# Altium schematic sheet CircuitoC1NoWroomRAJP.SchDoc
size A4; SheetNumber: 1; SheetTotal: 1
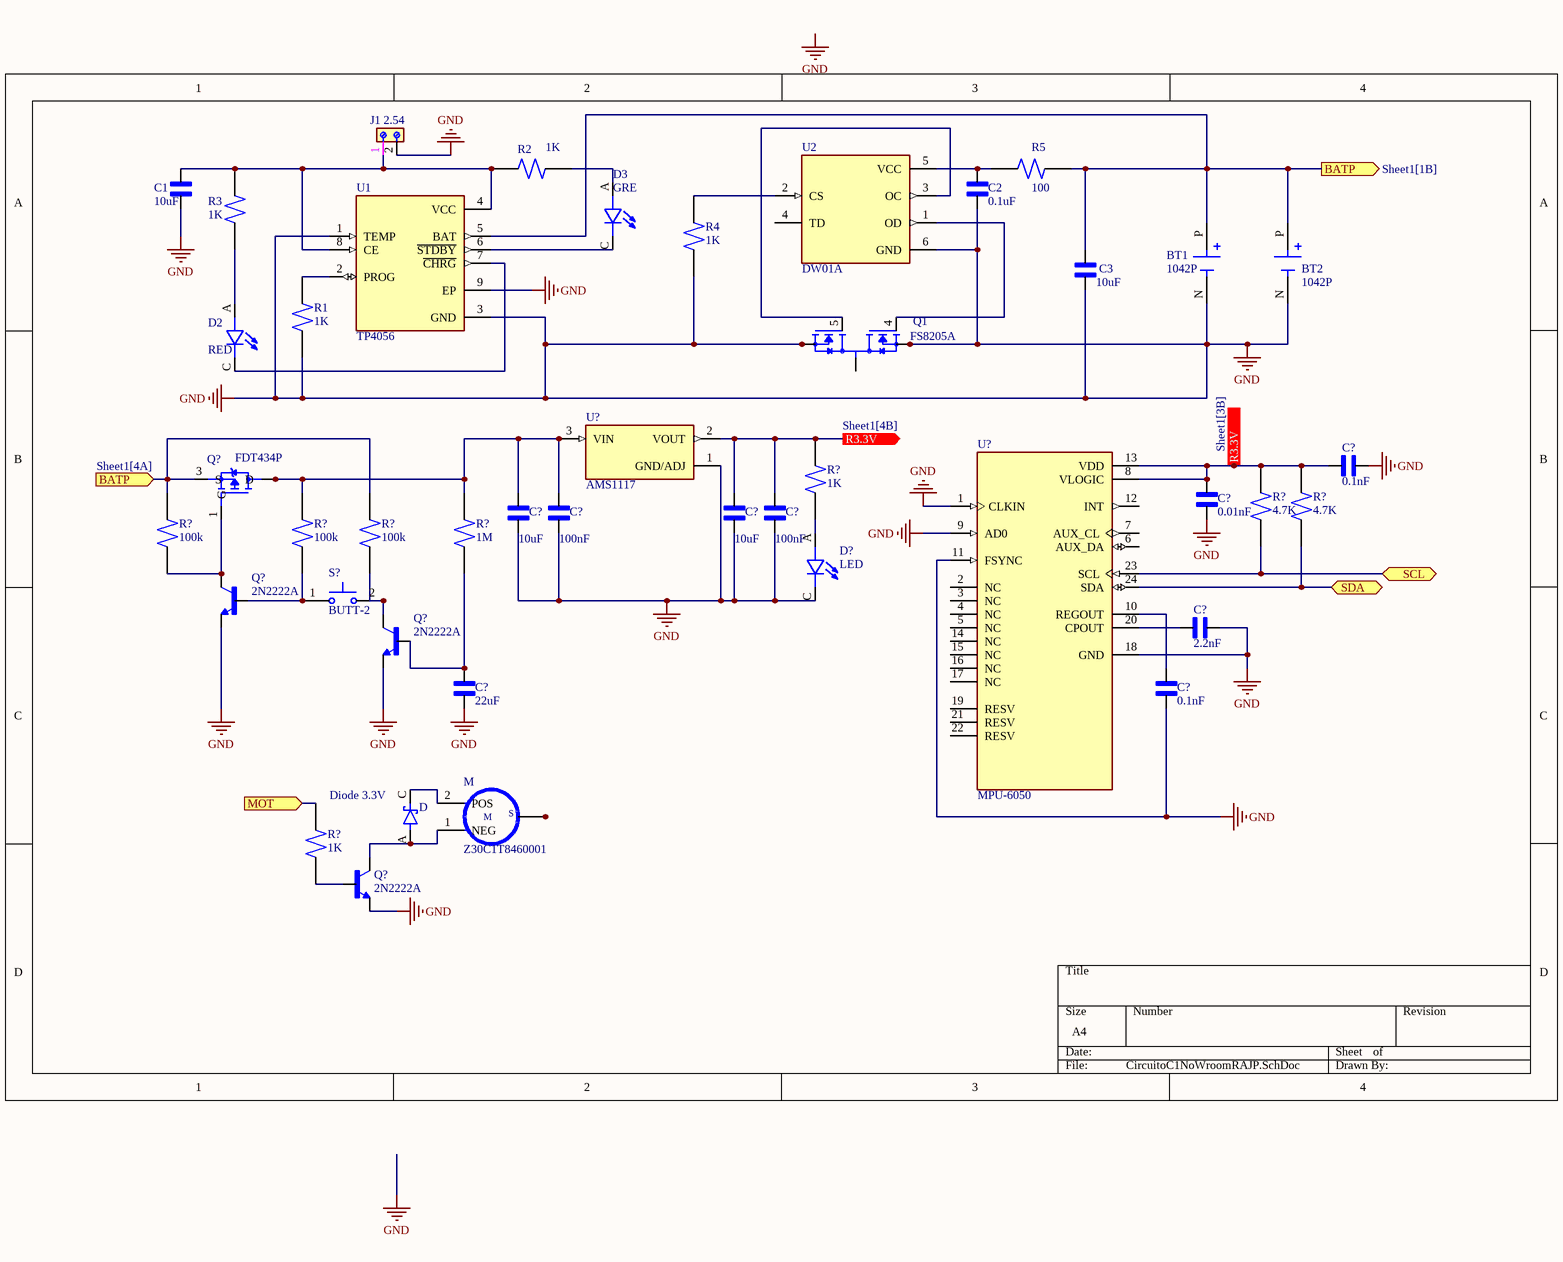
[diagram p0: CircuitoC1NoWroomRAJP.SchDoc]

## Parts
(Parts that share a designator on the sheet are numbered #1, #2 ... from top to bottom, then left to right.)
BT1  1042P  [BAT_1042P]
BT2  1042P  [BAT_1042P]
C1  10uF  [CAPC2012X94N]
C2  0.1uF  [CAPC2012X94N]
C3  10uF  [CAPC2012X94N]
C?#1  0.1nF  [CAPC2012X94N]
C?#2  0.01nF  [CAPC2012X94N]
C?#3  10uF  [CAPC2012X94N]
C?#4  100nF  [CAPC2012X94N]
C?#5  10uF  [CAPC2012X94N]
C?#6  100nF  [CAPC2012X94N]
C?#7  2.2nF  [CAPC2012X94N]
C?#8  22uF  [CAPC2012X94N]
C?#9  0.1nF  [CAPC2012X94N]
D  Diode 3.3V  [DIOSC130X200X100-2N]
D2  RED  [LEDC2012X120N]
D3  GRE  [LEDC2012X120N]
D?  LED  [LEDC2012X120N]
J1  2.54  [691210910002]
M  Z30C1T8460001  [XDCR_Z30C1T8460001]
Q1  FS8205A  [SOP65P640X120-8N]
Q?#1  FDT434P  [SOT230P700X180-4N]
Q?#2  2N2222A  [TO92254P470H750-3]
Q?#3  2N2222A  [TO92254P470H750-3]
Q?#4  2N2222A  [TO92254P470H750-3]
R1  1K  [RESC2012X60N]
R2  1K  [RESC2012X60N]
R3  1K  [RESC2012X60N]
R4  1K  [RESC2012X60N]
R5  100  [RESC2012X60N]
R?#1  1K  [RESC2012X60N]
R?#2  4.7K  [RESC2012X60N]
R?#3  4.7K  [RESC2012X60N]
R?#4  100k  [RESC2012X60N]
R?#5  100k  [RESC2012X60N]
R?#6  100k  [RESC2012X60N]
R?#7  1M  [RESC2012X60N]
R?#8  1K  [RESC2012X60N]
S?  BUTT-2  [SW_BUTT-2]
U1  TP4056  [SOP127P600X175-9N]
U2  DW01A  [SOT95P280X145-6N]
U?#1  AMS1117  [SOT229P700X180-4N]
U?#2  MPU-6050  [QFN50P400X400X95-24N]

## Ports
BATP (in, see Sheet1[4A]), BATP (out, see Sheet1[1B]), MOT (in), R3.3V (in, see Sheet1[3B]), R3.3V (out, see Sheet1[4B]), SCL (bidir), SDA (bidir)

## Nets
GND: BT1.N(NEG) BT2.N(NEG) C1.1 C2.2 C3.1 C?#1.2 C?#2.1 C?#3.1 C?#4.1 C?#5.1 C?#6.1 C?#7.1 C?#8.1 C?#9.1 D?.C J1.2 Q1.2(S1) Q1.3(S1) Q1.6(S2) Q1.7(S2) Q?#2.1(E) Q?#3.1(E) Q?#4.1(E) R1.1 R4.1 U1.1(TEMP) U1.3(GND) U1.9(EP) U2.6(GND) U?#1.1(GND/ADJ) U?#2.1(CLKIN) U?#2.9(AD0) U?#2.11(FSYNC) U?#2.18(GND)
BATP: BT1.P(POS) BT2.P(POS) C3.2 Q?#1.3(S) R5.2 R?#4.2 R?#6.2 U1.5(BAT) ; port BATP
MOT: R?#8.2 ; port MOT
R3.3V: C?#1.1 C?#2.2 C?#5.2 C?#6.2 R?#1.2 R?#2.2 R?#3.2 U?#1.2(VOUT) U?#2.8(VLOGIC) U?#2.13(VDD) ; port R3.3V
SCL: R?#2.1 U?#2.23(SCL) ; port SCL
SDA: R?#3.1 U?#2.24(SDA) ; port SDA
NetC1_2: C1.2 J1.1 R2.1 R3.2 U1.4(VCC) U1.8(CE)
NetC2_1: C2.1 R5.1 U2.5(VCC)
NetC?#3_2: C?#3.2 C?#4.2 Q?#1.2(D) Q?#1.4(D) R?#5.2 R?#7.2 U?#1.3(VIN)
NetC?#7_2: C?#7.2 U?#2.20(CPOUT)
NetC?#8_2: C?#8.2 Q?#3.2(B) R?#7.1
NetC?#9_2: C?#9.2 U?#2.10(REGOUT)
NetD2_A: D2.A R3.1
NetD2_C: D2.C U1.7(~{CHRG})
NetD3_A: D3.A R2.2
NetD3_C: D3.C U1.6(~{STDBY})
NetD?_A: D?.A R?#1.1
NetD_A: D.A M.1(NEG) Q?#4.3(C)
NetD_C: D.C(K) M.2(POS)
NetM_3: M.3(SHIELD) M.4(SHIELD) M.5(SHIELD) M.6(SHIELD)
NetQ1_1: Q1.1(D12) Q1.8(D12)
NetQ1_4: Q1.4(G1) U2.1(OD)
NetQ1_5: Q1.5(G2) U2.3(OC)
NetQ?#1_1: Q?#1.1(G) Q?#2.3(C) R?#4.1
NetQ?#2_2: Q?#2.2(B) R?#5.1 S?.1
NetQ?#3_3: Q?#3.3(C) R?#6.1 S?.2
NetQ?#4_2: Q?#4.2(B) R?#8.1
NetR1_2: R1.2 U1.2(PROG)
NetR4_2: R4.2 U2.2(CS)

Not connected (* = marked no-connect by the designer): U2 4(TD); U?#2 2(NC) 3(NC) 4(NC) 5(NC) 6(AUX_DA) 7(AUX_CL) 12(INT) 14(NC) 15(NC) 16(NC) 17(NC) 19(RESV) 21(RESV) 22(RESV)

## Notes on the sheet
- Labels drawn without touching a wire or pin: GND
- (in symbol Z30C1T8460001) S

## Library data of the parts
BT1 BT2 = 1042P: SMT Polarized Holder for 18650 Battery; MF: Keystone Electronics; Price: None; Purchase-URL: https://pricing.snapeda.com/search/part/1042P/?ref=eda; Check_prices: https://www.snapeda.com/parts/1042P/Keystone+Electronics/view-part/?ref=eda; Value: *; SnapEDA_Link: https://www.snapeda.com/parts/1042P/Keystone+Electronics/view-part/?ref=snap; Availability: In Stock; MP: 1042P; Package: None
C1-C3 C?#1-C?#9 = 0805YC103J4T2A: 10000 pF Â±5% 16V Ceramic Capacitor X7R 0805 (2012 Metric); MF: AVX; SnapEDA_Link: https://www.snapeda.com/parts/0805YC103J4T2A/AVX/view-part/?ref=snap; Package: 2012 AVX; Value: *; MP: 0805YC103J4T2A; Check_prices: https://www.snapeda.com/parts/0805YC103J4T2A/AVX/view-part/?ref=eda
D = SD0805S040S0R1: Diode Schottky 40V 100mA (DC) Surface Mount 0805 (2012 Metric); MF: AVX; DigiKey-Purchase-URL: https://snapeda.com/shop?store=DigiKey&id=809038; Arrow_Electronics-Purchase-URL: https://snapeda.com/shop?store=Arrow+Electronics&id=809038; Availability: Good; Price: None; Value: *; SnapEDA_Link: https://www.snapeda.com/parts/SD0805S040S0R1/AVX/view-part/809038/?ref=snap; MP: SD0805S040S0R1; Package: 0805 AVX; Mouser-Purchase-URL: https://snapeda.com/shop?store=Mouser&id=809038
D2 D3 D? = SML-LXT0805IW-TR: LED;Red;11mcd;0.061In.Dia.;SMD;100mA;2V Vf;635nm;140deg;SMD;White Diffused;5V Vr | Lumex SML-LXT0805IW-TR; MF: Lumex Opto/Components; SnapEDA_Link: https://www.snapeda.com/parts/SML-LXT0805IW-TR/Lumex+Opto%252FComponents+Inc./view-part/?ref=snap; Package: 0805 Lumex; Value: *; MP: SML-LXT0805IW-TR; Check_prices: https://www.snapeda.com/parts/SML-LXT0805IW-TR/Lumex+Opto%252FComponents+Inc./view-part/?ref=eda
J1 = 691210910002: MF: {'manufacturer': u'W\xfcrth Elektronik'}; Package: None; Price: None; Value: *; MP: 691210910002; Availability: Unavailable
M = Z30C1T8460001: DC Motor Vibration, ERM 15000 RPM 2.7VDC; MF: Jinlong Machinery; Package: Jinlong Machinery &amp; Electronics; SnapEDA_Link: https://www.snapeda.com/parts/Z30C1T8460001/Jinlong%20Machinery%20%26%20Electronics%2C%20Inc./view-part/585010/?ref=snap; MP: Z30C1T8460001; Value: *; Availability: Unavailable; Price: None
Q1 = FS8205A: MF: Fortune Semiconductor; SnapEDA_Link: https://www.snapeda.com/parts/FS8205A/Fortune+Semiconductor/view-part/?ref=snap; Package: Package; Value: *; MP: FS8205A; Check_prices: https://www.snapeda.com/parts/FS8205A/Fortune+Semiconductor/view-part/?ref=eda
Q?#1 = FDT434P: P-Channel 20 V 6A (Ta) 3W (Ta) Surface Mount SOT-223-4; MF: ON; SnapEDA_Link: https://www.snapeda.com/parts/FDT434P/Onsemi/view-part/?ref=snap; Package: SOT-223-4 Fairchild Semiconductor; Value: *; MP: FDT434P; Check_prices: https://www.snapeda.com/parts/FDT434P/Onsemi/view-part/?ref=eda
Q?#2-Q?#4 = 2N2222A: BJT, TO-92, 40V, 600mA, NPN, 0.625W, 150Â°C; MF: Diotec Semiconductor; SnapEDA_Link: https://www.snapeda.com/parts/2N2222A/Diotec/view-part/?ref=snap; Package: TO-92 Diotec; Value: *; MP: 2N2222A; Check_prices: https://www.snapeda.com/parts/2N2222A/Diotec/view-part/?ref=eda
R1-R5 R?#1-R?#8 = RC0805FR-07910RL: 910 Ohms Â±1% 0.125W, 1/8W Chip Resistor 0805 (2012 Metric) Moisture Resistant Thick Film; MF: Yageo; Package: 2012 Rohm Semiconductor; Value: *; Purchase-URL: https://pricing.snapeda.com/search/part/RC0805FR-07910RL/?ref=eda; Availability: In Stock; MP: RC0805FR-07910RL; Price: None
S? = BUTT-2: Tactile Switches MINI PUSH BUTTON SWITCH 2-PIN QTY. 4; MF: Gravitech; Purchase-URL: https://pricing.snapeda.com/search/part/BUTT-2/?ref=eda; Package: None; Value: *; Check_prices: https://www.snapeda.com/parts/BUTT-2/Gravitech/view-part/?ref=eda; SnapEDA_Link: https://www.snapeda.com/parts/BUTT-2/Gravitech/view-part/?ref=snap; Availability: In Stock; Price: None; MP: BUTT-2
U1 = TP4056: Complete single cell Li-Ion battery with a constant current / constant voltage linear charger; MF: NanJing Top Power ASIC Corp.; Check_prices: https://www.snapeda.com/parts/TP4056/NanJing+Top+Power+ASIC+Corp./view-part/?ref=eda; SnapEDA_Link: https://www.snapeda.com/parts/TP4056/NanJing+Top+Power+ASIC+Corp./view-part/?ref=snap; Price: None; Availability: Not in stock; Package: Package; MP: TP4056; Value: *
U2 = DW01A: One Cell Lithium-ion/Polymer Battery Protection IC; MF: Fortune Semiconductor; SnapEDA_Link: https://www.snapeda.com/parts/DW01A/Fortune+Semiconductor/view-part/?ref=snap; Package: SOT-23-6 Fortune Semiconductor; Value: *; MP: DW01A; Check_prices: https://www.snapeda.com/parts/DW01A/Fortune+Semiconductor/view-part/?ref=eda
U?#1 = AMS1117-3.3: LDO Voltage Regulators 800MA LDO LINEAR REG; MF: ams AG; SnapEDA_Link: https://www.snapeda.com/parts/AMS1117-3.3/ams/view-part/?ref=snap; Package: SOT-223 Seeed Technology; Value: *; MP: AMS1117-3.3; Check_prices: https://www.snapeda.com/parts/AMS1117-3.3/ams/view-part/?ref=eda
U?#2 = MPU-6050: MPU-6050 series Accelerometer, Gyroscope, 3 Axis Sensor Evaluation Board; MF: TDK InvenSense; SnapEDA_Link: https://www.snapeda.com/parts/MPU-6050/TDK+InvenSense/view-part/?ref=snap; Package: QFN-24 InvenSense; Value: *; MP: MPU-6050; Check_prices: https://www.snapeda.com/parts/MPU-6050/TDK+InvenSense/view-part/?ref=eda